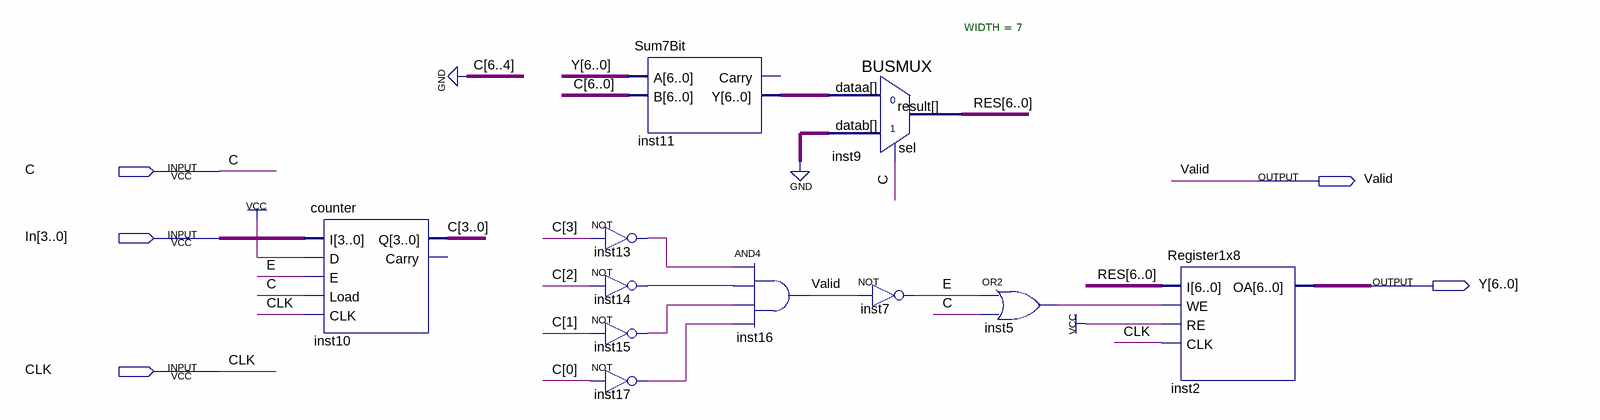
[diagram p0: schematic sheet]
// Quartus schematic Datapath.bdf as structural Verilog: 11 symbols, 5 pins
module Datapath (
  input  C,
  input  [3:0] In,
  input  CLK,
  output Valid,
  output [6:0] Y
);

  wire E, inst5_out, inst13_out, inst14_out, inst15_out, inst17_out;
  wire [3:0] C_bus;
  wire [6:0] inst11_y, RES;

  counter inst10 (.I(In), .D(1'b1), .E(E), .Load(C), .CLK(CLK), .Q(C_bus));  // open: Carry
  Sum7Bit inst11 (.A(Y), .B({3'b000, C_bus}), .Y(inst11_y));  // open: Carry
  not inst13 (inst13_out, C_bus[3]);
  not inst14 (inst14_out, C_bus[2]);
  not inst15 (inst15_out, C_bus[1]);
  not inst17 (inst17_out, C_bus[0]);
  and inst16 (Valid, inst13_out, inst14_out, inst15_out, inst17_out);
  BUSMUX #(.WIDTH(7)) inst9 (.datab({7{1'b0}}), .sel(C), .dataa(inst11_y), .result(RES));
  not inst7 (E, Valid);
  or inst5 (inst5_out, E, C);
  Register1x8 inst2 (.I(RES), .WE(inst5_out), .RE(1'b1), .CLK(CLK), .OA(Y));
endmodule
